# EAGLE schematic tyl (EAGLE 6.4)
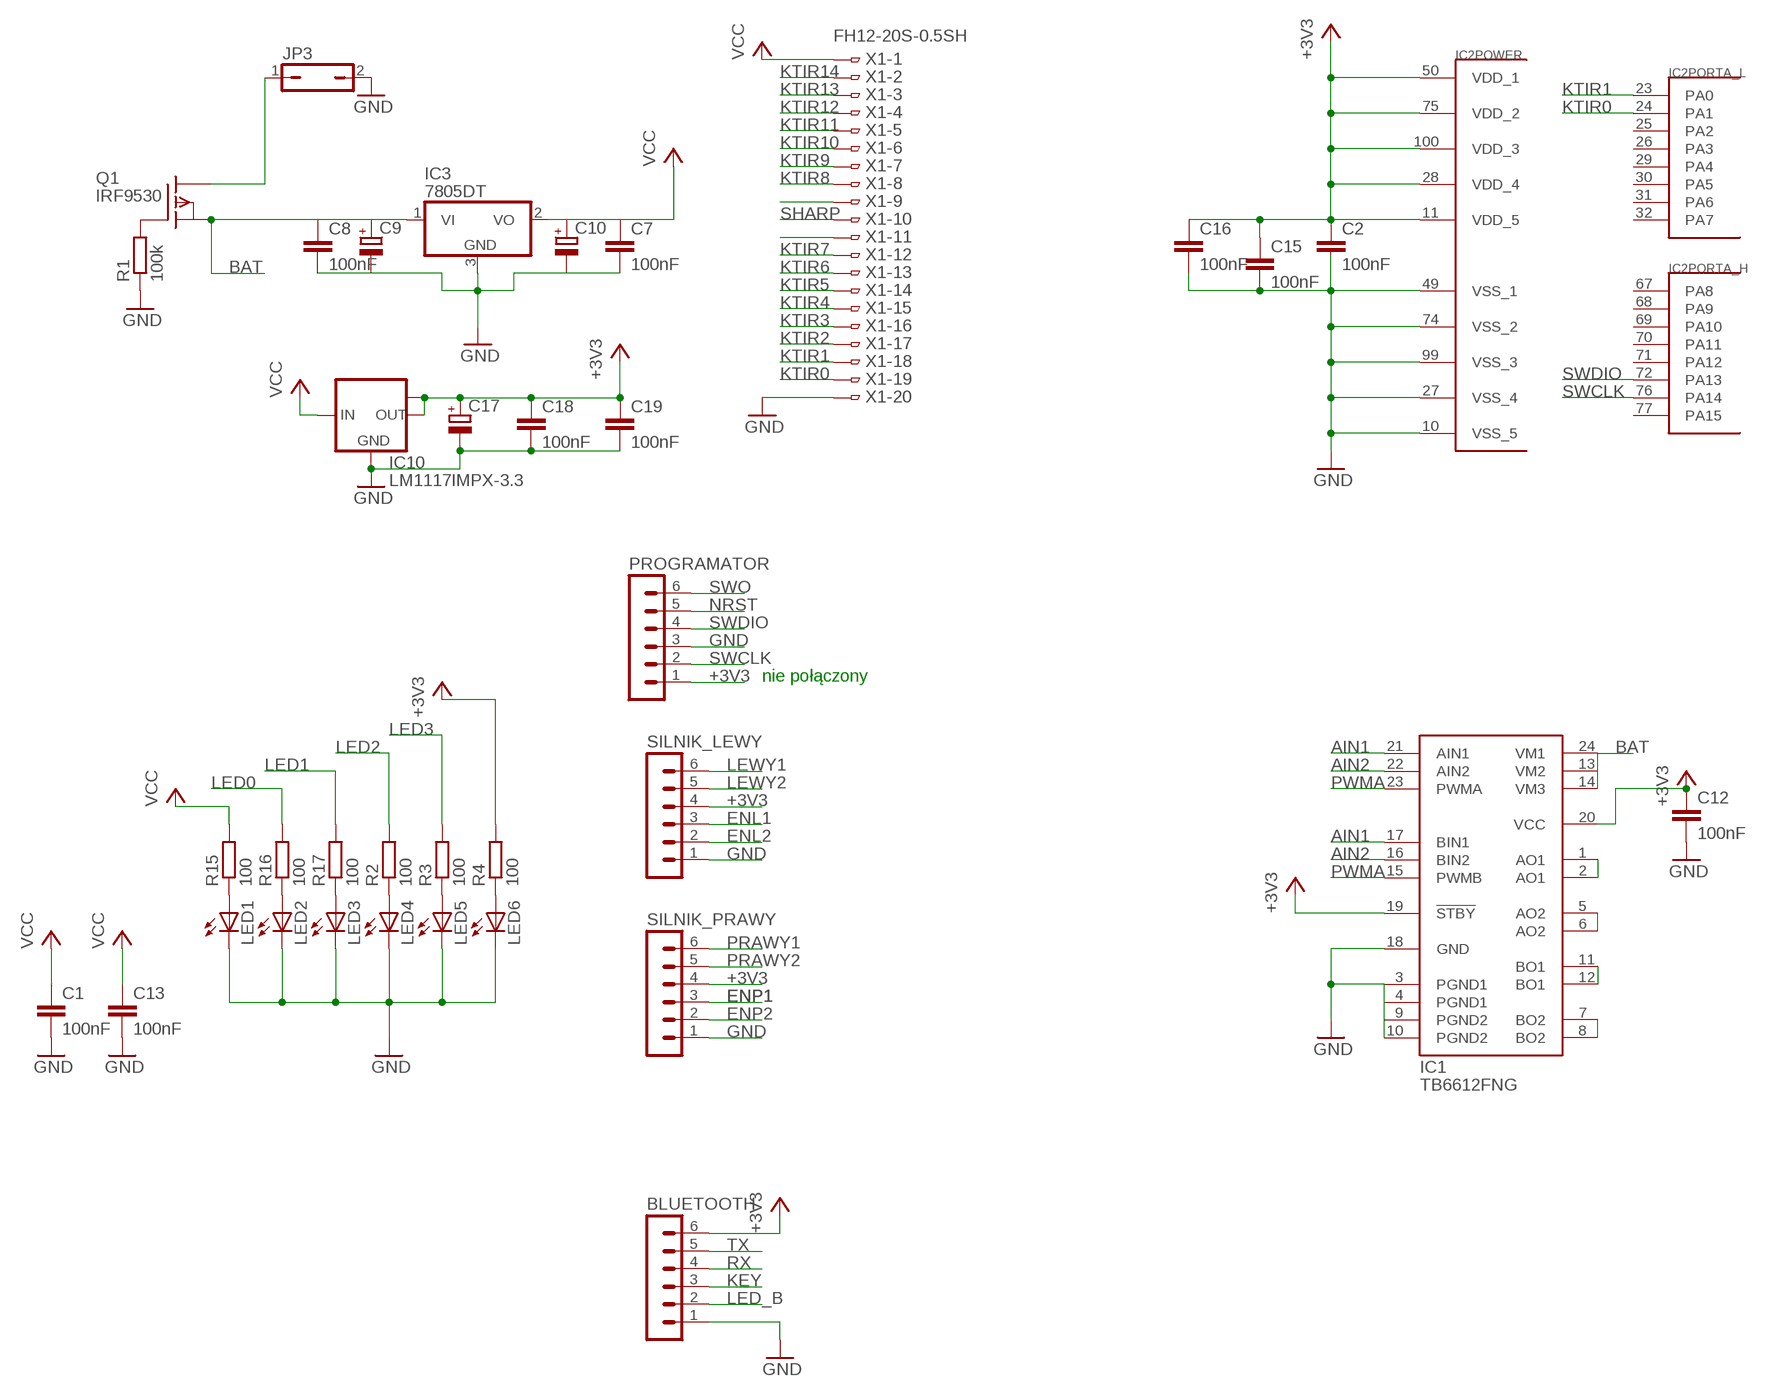
[diagram p0: schematic, sheet 1, part 1 of 2]
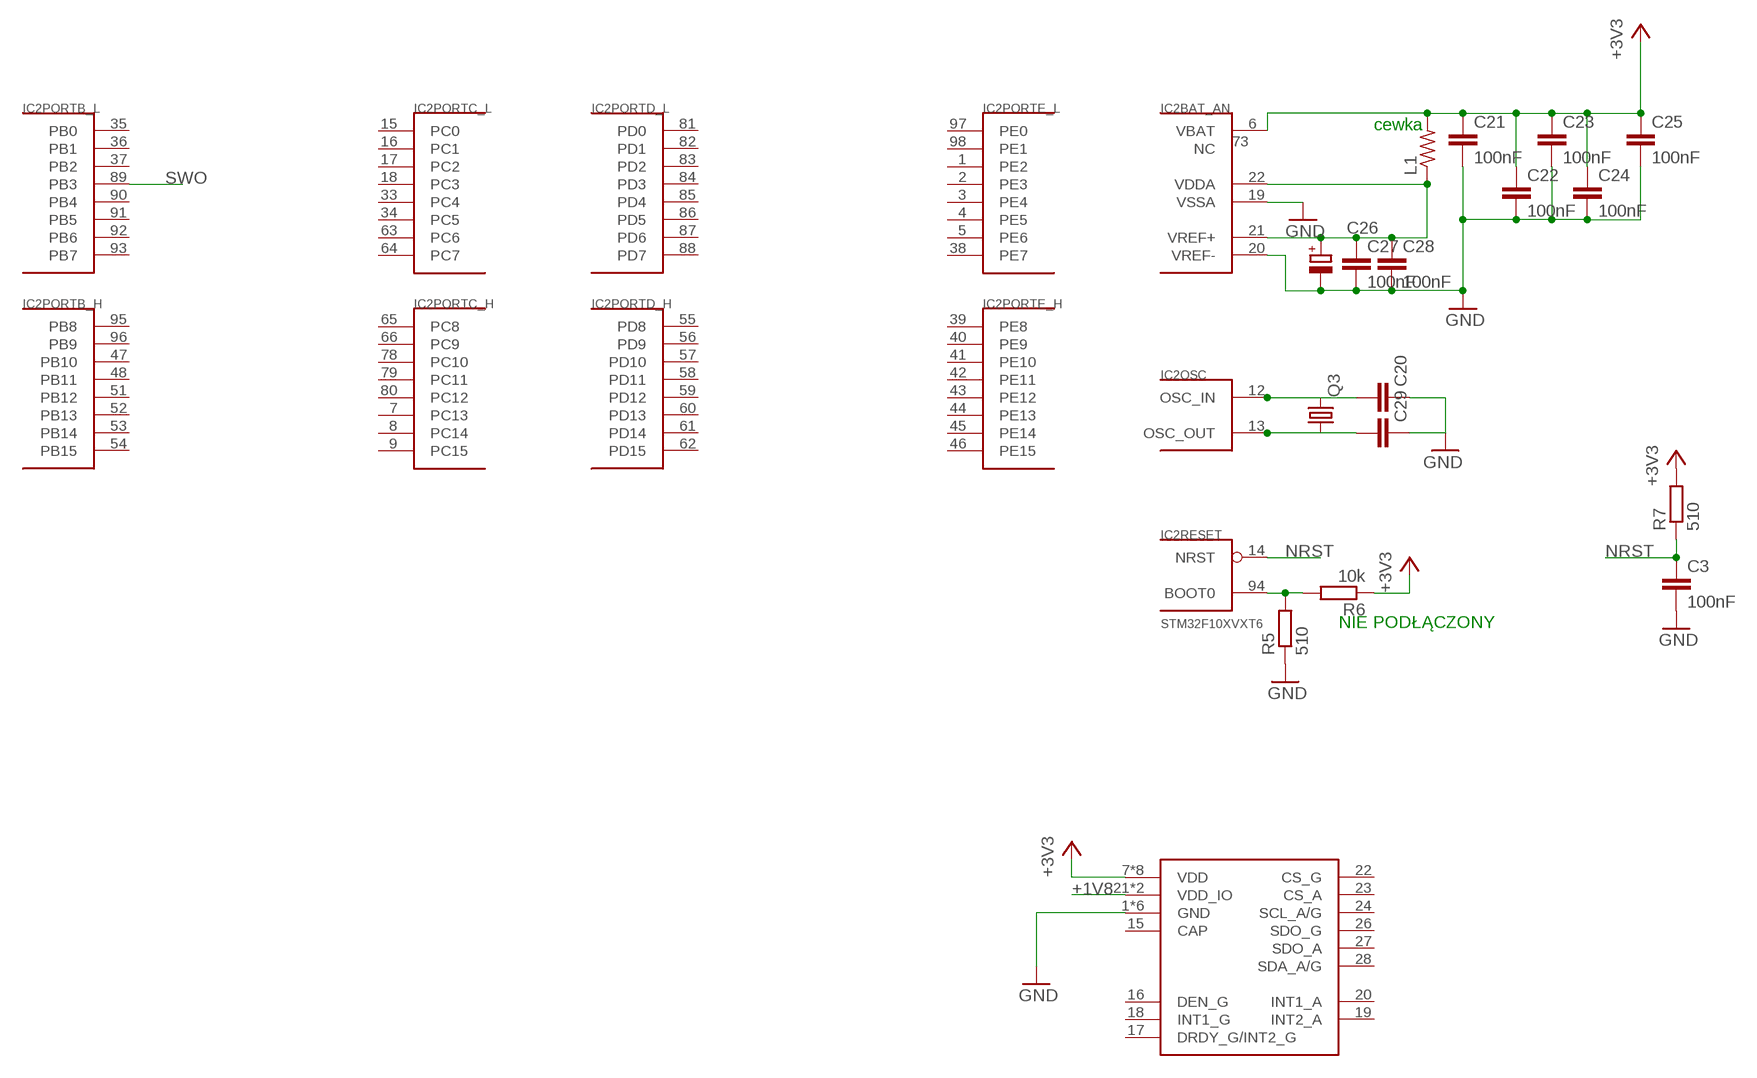
[diagram p1: schematic, sheet 1, part 2 of 2]

## Parts
BLUETOOTH  MA06-1  [MA06-1]
C1  100nF  C-EUC0603  [C0603]
C2  100nF  C-EUC0603  [C0603]
C3  100nF  C-EUC0603  [C0603]
C7  100nF  C-EUC0603  [C0603]
C8  100nF  C-EUC0603  [C0603]
C9  CPOL-EUSMCA  [SMC_A]
C10  CPOL-EUSMCA  [SMC_A]
C12  100nF  C-EUC0603  [C0603]
C13  100nF  C-EUC0603  [C0603]
C15  100nF  C-EUC0603  [C0603]
C16  100nF  C-EUC0603  [C0603]
C17  CPOL-EUSMCA  [SMC_A]
C18  100nF  C-EUC0603  [C0603]
C19  100nF  C-EUC0603  [C0603]
C20  C-EUC0603  [C0603]
C21  100nF  C-EUC0603  [C0603]
C22  100nF  C-EUC0603  [C0603]
C23  100nF  C-EUC0603  [C0603]
C24  100nF  C-EUC0603  [C0603]
C25  100nF  C-EUC0603  [C0603]
C26  CPOL-EUSMCA  [SMC_A]
C27  100nF  C-EUC0603  [C0603]
C28  100nF  C-EUC0603  [C0603]
C29  C-EUC0603  [C0603]
IC1  TB6612FNG  [SSOP24]
IC2  STM32F10XVXT6  [TQFP100]
IC3  7805DT  [TO252]
IC10  LM1117IMPX-3.3  [SOT223]
JP3  JP1Q  [JP1]
L1  R-US_R0805  [R0805]
LED1  LEDSML0805  [SML0805]
LED2  LEDSML0805  [SML0805]
LED3  LEDSML0805  [SML0805]
LED4  LEDSML0805  [SML0805]
LED5  LEDSML0805  [SML0805]
LED6  LEDSML0805  [SML0805]
PROGRAMATOR  MA06-1  [MA06-1]
Q1  IRF9530  [TO220]
Q3  CRYSTALSM49  [SM49]
R1  100k  R-EU_R0805  [R0805]
R2  100  R-EU_R0805  [R0805]
R3  100  R-EU_R0805  [R0805]
R4  100  R-EU_R0805  [R0805]
R5  510  R-EU_R0805  [R0805]
R6  10k  R-EU_R0805  [R0805]
R7  510  R-EU_R0805  [R0805]
R15  100  R-EU_R0805  [R0805]
R16  100  R-EU_R0805  [R0805]
R17  100  R-EU_R0805  [R0805]
SILNIK_LEWY  MA06-1  [MA06-1]
SILNIK_PRAWY  MA06-1  [MA06-1]
U$1  LSM330DLC  [LGA-28L]
X1  FH12-20S-0.5SH  [FH12-20S-0.5SH]

## Nets
+1V8: U$1.21(VDD_IO) U$1.25(VDD_IO)
+3V3: BLUETOOTH.6 C2.1 C12.1 C15.1 C16.1 C17.+ C18.1 C19.1 C21.1 C22.1 C23.1 C24.1 C25.1 IC1.19(!STBY) IC1.20(VCC) IC2.6(BAT_AN:VBAT) IC2.11(POWER:VDD_5) IC2.28(POWER:VDD_4) IC2.50(POWER:VDD_1) IC2.75(POWER:VDD_2) IC2.100(POWER:VDD_3) IC10.2(OUT) IC10.TAB(OUT1) L1.2 PROGRAMATOR.1 R4.2 R6.1 R7.2 SILNIK_LEWY.4 SILNIK_PRAWY.4 U$1.7(VDD) U$1.8(VDD) U$1.9(VDD) U$1.10(VDD) U$1.11(VDD) U$1.12(VDD) U$1.13(VDD) U$1.14(VDD)
AIN1: IC1.17(BIN1) IC1.21(AIN1)
AIN2: IC1.16(BIN2) IC1.22(AIN2)
BAT: C8.1 C9.+ IC1.13(VM2) IC1.14(VM3) IC1.24(VM1) IC3.1(VI) Q1.3(S)
ENL1: SILNIK_LEWY.3
ENL2: SILNIK_LEWY.2
ENP1: SILNIK_PRAWY.3
ENP2: SILNIK_PRAWY.2
GND: BLUETOOTH.1 C1.2 C2.2 C3.2 C7.2 C8.2 C9.- C10.- C12.2 C13.2 C15.2 C16.2 C17.- C18.2 C19.2 C20.1 C21.2 C22.2 C23.2 C24.2 C25.2 C26.- C27.2 C28.2 C29.1 IC1.3(PGND1) IC1.4(PGND1) IC1.9(PGND2) IC1.10(PGND2) IC1.18(GND) IC2.10(POWER:VSS_5) IC2.19(BAT_AN:VSSA) IC2.20(BAT_AN:VREF-) IC2.27(POWER:VSS_4) IC2.49(POWER:VSS_1) IC2.74(POWER:VSS_2) IC2.99(POWER:VSS_3) IC3.3(GND) IC10.1(GND) JP3.2 LED1.C LED2.C LED3.C LED4.C LED5.C LED6.C PROGRAMATOR.3 R1.1 R5.1 SILNIK_LEWY.1 SILNIK_PRAWY.1 U$1.1(GND) U$1.2(GND) U$1.3(GND) U$1.4(GND) U$1.5(GND) U$1.6(GND) X1.20
KEY: BLUETOOTH.3
KTIR0: IC2.24(PORTA_L:PA1) X1.19
KTIR1: IC2.23(PORTA_L:PA0) X1.18
KTIR2: X1.17
KTIR3: X1.16
KTIR4: X1.15
KTIR5: X1.14
KTIR6: X1.13
KTIR7: X1.12
KTIR8: X1.8
KTIR9: X1.7
KTIR10: X1.6
KTIR11: X1.5
KTIR12: X1.4
KTIR13: X1.3
KTIR14: X1.2
LED0: R16.2
LED1: R17.2
LED2: R2.2
LED3: R3.2
LED_B: BLUETOOTH.2
LEWY1: IC1.11(BO1) IC1.12(BO1) SILNIK_LEWY.6
LEWY2: IC1.7(BO2) IC1.8(BO2) SILNIK_LEWY.5
N$1: IC1.1(AO1) IC1.2(AO1)
N$2: JP3.1 Q1.2(D)
N$3: Q1.1(G) R1.2
N$4: LED4.A R2.1
N$5: C26.+ C27.1 C28.1 IC2.21(BAT_AN:VREF+) IC2.22(BAT_AN:VDDA) L1.1
N$6: LED5.A R3.1
N$7: LED6.A R4.1
N$8: IC1.5(AO2) IC1.6(AO2)
N$9: IC2.94(RESET:BOOT0) R5.2 R6.2
N$10: LED1.A R15.1
N$11: C20.2 IC2.12(OSC:OSC_IN) Q3.2
N$12: C29.2 IC2.13(OSC:OSC_OUT) Q3.1
N$14: LED2.A R16.1
N$16: LED3.A R17.1
N$34: X1.11
N$38: X1.9
NRST: C3.1 IC2.14(RESET:NRST) PROGRAMATOR.5 R7.1
PRAWY1: SILNIK_PRAWY.6
PRAWY2: SILNIK_PRAWY.5
PWMA: IC1.15(PWMB) IC1.23(PWMA)
RX: BLUETOOTH.4
SHARP: X1.10
SWCLK: IC2.76(PORTA_H:PA14) PROGRAMATOR.2
SWDIO: IC2.72(PORTA_H:PA13) PROGRAMATOR.4
SWO: IC2.89(PORTB_L:PB3) PROGRAMATOR.6
TX: BLUETOOTH.5
VCC: C1.1 C7.1 C10.+ C13.1 IC3.2(VO) IC10.3(IN) R15.2 X1.1
Unconnected: IC2.1(PORTE_L:PE2) IC2.2(PORTE_L:PE3) IC2.3(PORTE_L:PE4) IC2.4(PORTE_L:PE5) IC2.5(PORTE_L:PE6) IC2.7(PORTC_H:PC13) IC2.8(PORTC_H:PC14) IC2.9(PORTC_H:PC15) IC2.15(PORTC_L:PC0) IC2.16(PORTC_L:PC1) IC2.17(PORTC_L:PC2) IC2.18(PORTC_L:PC3) IC2.25(PORTA_L:PA2) IC2.26(PORTA_L:PA3) IC2.29(PORTA_L:PA4) IC2.30(PORTA_L:PA5) IC2.31(PORTA_L:PA6) IC2.32(PORTA_L:PA7) IC2.33(PORTC_L:PC4) IC2.34(PORTC_L:PC5) IC2.35(PORTB_L:PB0) IC2.36(PORTB_L:PB1) IC2.37(PORTB_L:PB2) IC2.38(PORTE_L:PE7) IC2.39(PORTE_H:PE8) IC2.40(PORTE_H:PE9) IC2.41(PORTE_H:PE10) IC2.42(PORTE_H:PE11) IC2.43(PORTE_H:PE12) IC2.44(PORTE_H:PE13) IC2.45(PORTE_H:PE14) IC2.46(PORTE_H:PE15) IC2.47(PORTB_H:PB10) IC2.48(PORTB_H:PB11) IC2.51(PORTB_H:PB12) IC2.52(PORTB_H:PB13) IC2.53(PORTB_H:PB14) IC2.54(PORTB_H:PB15) IC2.55(PORTD_H:PD8) IC2.56(PORTD_H:PD9) IC2.57(PORTD_H:PD10) IC2.58(PORTD_H:PD11) IC2.59(PORTD_H:PD12) IC2.60(PORTD_H:PD13) IC2.61(PORTD_H:PD14) IC2.62(PORTD_H:PD15) IC2.63(PORTC_L:PC6) IC2.64(PORTC_L:PC7) IC2.65(PORTC_H:PC8) IC2.66(PORTC_H:PC9) IC2.67(PORTA_H:PA8) IC2.68(PORTA_H:PA9) IC2.69(PORTA_H:PA10) IC2.70(PORTA_H:PA11) IC2.71(PORTA_H:PA12) IC2.73(BAT_AN:NC) IC2.77(PORTA_H:PA15) IC2.78(PORTC_H:PC10) IC2.79(PORTC_H:PC11) IC2.80(PORTC_H:PC12) IC2.81(PORTD_L:PD0) IC2.82(PORTD_L:PD1) IC2.83(PORTD_L:PD2) IC2.84(PORTD_L:PD3) IC2.85(PORTD_L:PD4) IC2.86(PORTD_L:PD5) IC2.87(PORTD_L:PD6) IC2.88(PORTD_L:PD7) IC2.90(PORTB_L:PB4) IC2.91(PORTB_L:PB5) IC2.92(PORTB_L:PB6) IC2.93(PORTB_L:PB7) IC2.95(PORTB_H:PB8) IC2.96(PORTB_H:PB9) IC2.97(PORTE_L:PE0) IC2.98(PORTE_L:PE1) U$1.15(CAP) U$1.16(DEN_G) U$1.17(DRDY_G/INT2_G) U$1.18(INT1_G) U$1.19(INT2_A) U$1.20(INT1_A) U$1.22(CS_G) U$1.23(CS_A) U$1.24(SCL_A/G) U$1.26(SDO_G) U$1.27(SDO_A) U$1.28(SDA_A/G)

## Notes on the sheet
- cewka
- NIE PODŁĄCZONY
- nie połączony

## Library data of the parts
BLUETOOTH PROGRAMATOR SILNIK_LEWY SILNIK_PRAWY = con-lstb:MA06-1: PIN HEADER; OC_FARNELL: unknown; OC_NEWARK: unknown
C1-C3 C7 C8 C12 C13 C15 C16 C18-C25 C27-C29 = rcl:C-EU: CAPACITOR, European symbol
C9 C10 C17 C26 = rcl:CPOL-EU: POLARIZED CAPACITOR, European symbol
IC1 = tb6612:TB6612FNG
IC2 = stm32:STM32F10XVXT6: STM32F101/103 100 pin LQFP
IC3 = linear:78*: Positive VOLTAGE REGULATOR Source: http://cache.national.com/ds/LM/LM78L05.pdf http://www.fairchildsemi.com/ds/LM/LM7805.pdf
IC10 = lm1117:LM1117IMPX-*
JP3 = jumper:JP1Q: JUMPER
L1 = rcl:R-US_: RESISTOR, American symbol
LED1-LED6 = led:LED: LED OSRAM: - CHIPLED LG R971, LG N971, LY N971, LG Q971, LY Q971, LO R971, LY R971 LH N974, LH R974 LS Q976, LO Q976, LY Q976 LO Q996 - Hyper CHIPLED LW Q18S LB Q993, LB Q99A, LB R99A - SideLED LS A670, LO A670, LY A670, LG A670, LP A670 LB A673, LV A673, LT A673, LW A673 LH A674 LY A675 LS A676, LA A676, LO A676, LY A676, LW A676 LS A679, LY A679, LG A679 - Hyper Micro SIDELED® LS Y876, LA Y876, LO Y876, LY Y876 LT Y87S - SmartLED LW L88C, LW L88S LB L89C, LB L89S, LG L890 LS L89K, LO L89K, LY L89K LS L896, LA L896, LO L896, LY L896 - TOPLED LS T670, LO T670, LY T670, LG T670, LP T670 LSG T670, LSP T670, LSY T670, LOP T670, LYG T670 LG T671, LOG T671, LSG T671 LB T673, LV T673, LT T673, LW T673 LH T674 LS T676, LA T676, LO T676, LY T676, LB T676, LH T676, LSB T676, LW T676 LB T67C, LV T67C, LT T67C, LS T67K, LO T67K, LY T67K, LW E67C LS E67B, LA E67B, LO E67B, LY E67B, LB E67C, LV E67C, LT E67C LW T67C LS T679, LY T679, LG T679 LS T770, LO T770, LY T770, LG T770, LP T770 LB T773, LV T773, LT T773, LW T773 LH T774 LS E675, LA E675, LY E675, LS T675 LS T776, LA T776, LO T776, LY T776, LB T776 LHGB T686 LT T68C, LB T68C - Hyper Mini TOPLED® LB M676 - Mini TOPLED Santana® LG M470 LS M47K, LO M47K, LY M47K Source: http://www.osram.convergy.de LUXEON: - LUMILED® LXK2-PW12-R00, LXK2-PW12-S00, LXK2-PW14-U00, LXK2-PW14-V00 LXK2-PM12-R00, LXK2-PM12-S00, LXK2-PM14-U00 LXK2-PE12-Q00, LXK2-PE12-R00, LXK2-PE12-S00, LXK2-PE14-T00, LXK2-PE14-U00 LXK2-PB12-K00, LXK2-PB12-L00, LXK2-PB12-M00, LXK2-PB14-N00, LXK2-PB14-P00, LXK2-PB14-Q00 LXK2-PR12-L00, LXK2-PR12-M00, LXK2-PR14-Q00, LXK2-PR14-R00 LXK2-PD12-Q00, LXK2-PD12-R00, LXK2-PD12-S00 LXK2-PH12-R00, LXK2-PH12-S00 LXK2-PL12-P00, LXK2-PL12-Q00, LXK2-PL12-R00 Source: www.luxeon.com KINGBRIGHT: KA-3528ASYC Source: www.kingbright.com
Q1 = transistor-fet:IRF9530: P-Channel Enhancement MOSFET (HEXFET); -100V; -12A; 0,3Ohm
Q3 = crystal:CRYSTAL: CRYSTAL; OC_FARNELL: unknown; OC_NEWARK: unknown
R1-R7 R15-R17 = rcl:R-EU_: RESISTOR, European symbol
U$1 = LSM330DLC:LSM330DLC
X1 = con-hirose:FH12-20S-0.5S: 0.5mm Pitch Connectors For FPC/FFC Source: Data sheet <http://www.hirose.co.jp/cataloge_hp/e58605370.pdf>; MPN: FH12-20S-0.5SH(55); OC_FARNELL: 1324549; OC_NEWARK: 34M6166